# Altium schematic sheet loom-rear-LV-box.SchDoc
size 420 x 297 mm
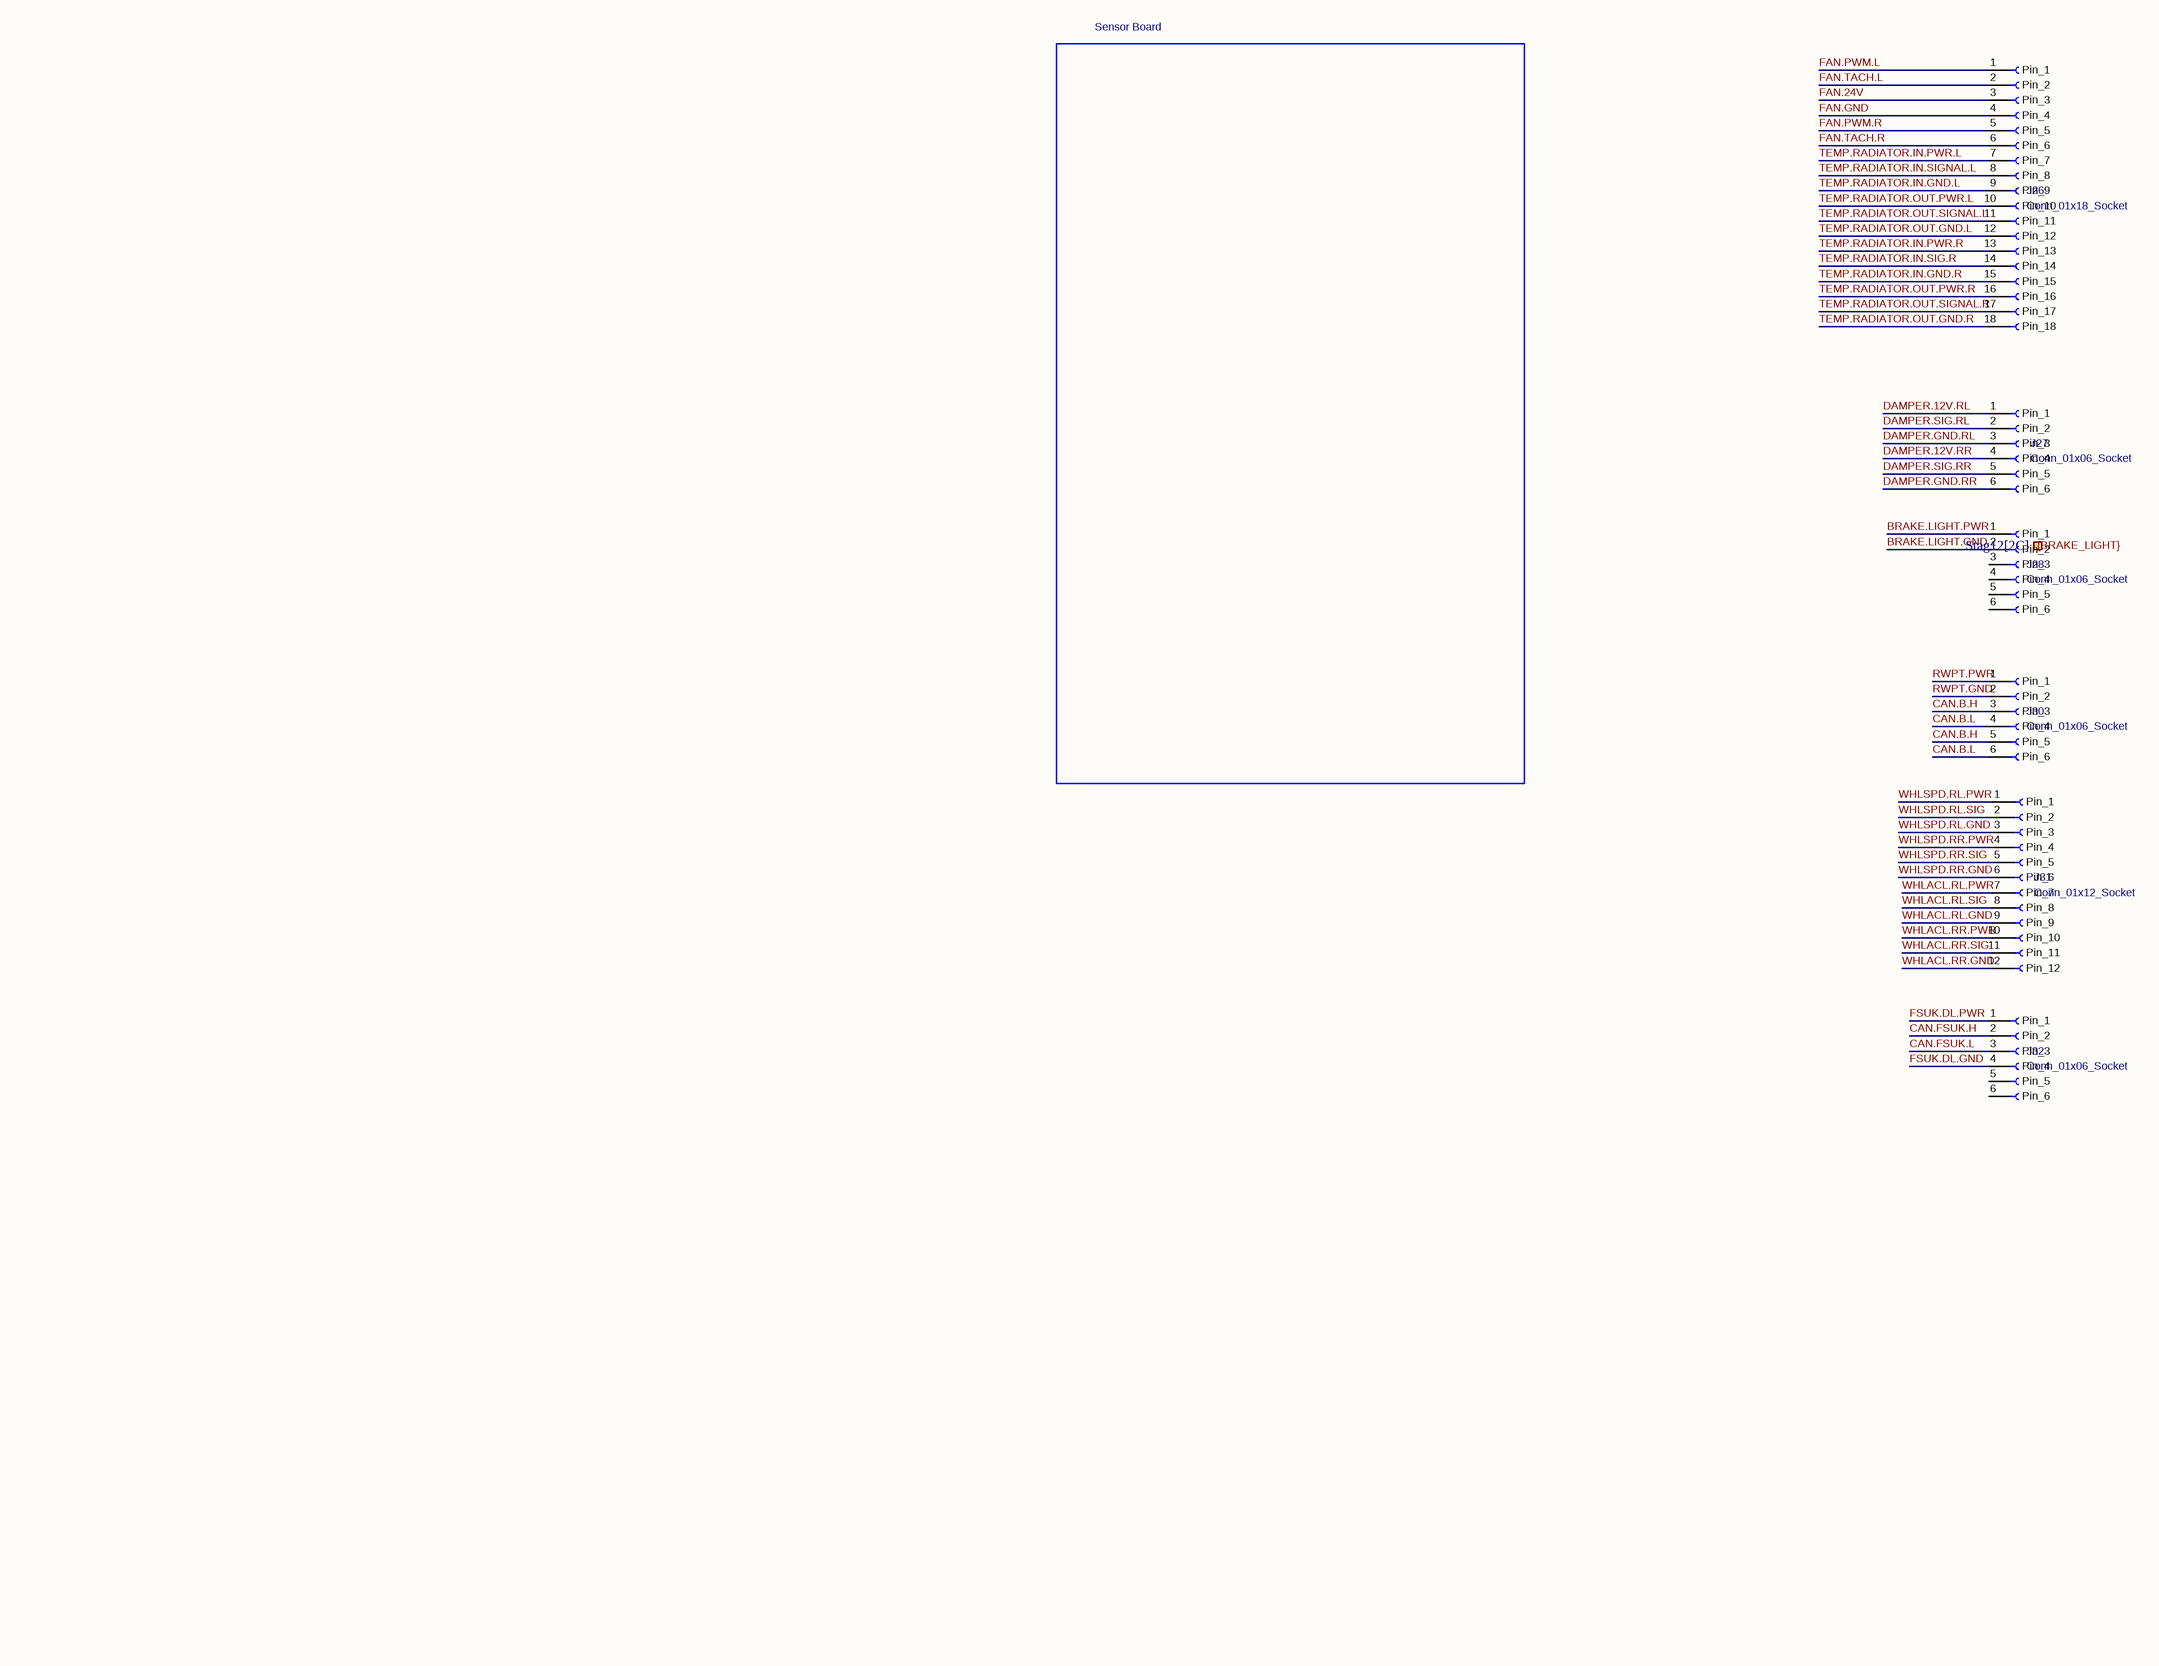
[diagram p0: loom-rear-LV-box.SchDoc]

## Parts
J26  Conn_01x18_Socket
J27  Conn_01x06_Socket
J28  Conn_01x06_Socket
J30  Conn_01x06_Socket
J31  Conn_01x12_Socket
J32  Conn_01x06_Socket

## Ports
{BRAKE_LIGHT} (in, see Stag12[2C])

## Nets
BRAKE.LIGHT.GND: J28.2(Pin_2)
BRAKE.LIGHT.PWR: J28.1(Pin_1)
CAN.B.H: J30.3(Pin_3) J30.5(Pin_5)
CAN.B.L: J30.4(Pin_4) J30.6(Pin_6)
CAN.FSUK.H: J32.2(Pin_2)
CAN.FSUK.L: J32.3(Pin_3)
DAMPER.12V.RL: J27.1(Pin_1)
DAMPER.12V.RR: J27.4(Pin_4)
DAMPER.GND.RL: J27.3(Pin_3)
DAMPER.GND.RR: J27.6(Pin_6)
DAMPER.SIG.RL: J27.2(Pin_2)
DAMPER.SIG.RR: J27.5(Pin_5)
FAN.24V: J26.3(Pin_3)
FAN.GND: J26.4(Pin_4)
FAN.PWM.L: J26.1(Pin_1)
FAN.PWM.R: J26.5(Pin_5)
FAN.TACH.L: J26.2(Pin_2)
FAN.TACH.R: J26.6(Pin_6)
FSUK.DL.GND: J32.4(Pin_4)
FSUK.DL.PWR: J32.1(Pin_1)
RWPT.GND: J30.2(Pin_2)
RWPT.PWR: J30.1(Pin_1)
TEMP.RADIATOR.IN.GND.L: J26.9(Pin_9)
TEMP.RADIATOR.IN.GND.R: J26.15(Pin_15)
TEMP.RADIATOR.IN.PWR.L: J26.7(Pin_7)
TEMP.RADIATOR.IN.PWR.R: J26.13(Pin_13)
TEMP.RADIATOR.IN.SIG.R: J26.14(Pin_14)
TEMP.RADIATOR.IN.SIGNAL.L: J26.8(Pin_8)
TEMP.RADIATOR.OUT.GND.L: J26.12(Pin_12)
TEMP.RADIATOR.OUT.GND.R: J26.18(Pin_18)
TEMP.RADIATOR.OUT.PWR.L: J26.10(Pin_10)
TEMP.RADIATOR.OUT.PWR.R: J26.16(Pin_16)
TEMP.RADIATOR.OUT.SIGNAL.L: J26.11(Pin_11)
TEMP.RADIATOR.OUT.SIGNAL.R: J26.17(Pin_17)
WHLACL.RL.GND: J31.9(Pin_9)
WHLACL.RL.PWR: J31.7(Pin_7)
WHLACL.RL.SIG: J31.8(Pin_8)
WHLACL.RR.GND: J31.12(Pin_12)
WHLACL.RR.PWR: J31.10(Pin_10)
WHLACL.RR.SIG: J31.11(Pin_11)
WHLSPD.RL.GND: J31.3(Pin_3)
WHLSPD.RL.PWR: J31.1(Pin_1)
WHLSPD.RL.SIG: J31.2(Pin_2)
WHLSPD.RR.GND: J31.6(Pin_6)
WHLSPD.RR.PWR: J31.4(Pin_4)
WHLSPD.RR.SIG: J31.5(Pin_5)

Not connected (* = marked no-connect by the designer): J28 3(Pin_3) 4(Pin_4) 5(Pin_5) 6(Pin_6); J32 5(Pin_5) 6(Pin_6)

## Notes on the sheet
- Sensor Board
- 1
- 2
- 3
- 4
- 5
- 6
- 7
- 8
- A
- B
- C
- D
- E
- Title:
- File: loom-rear-LV-box.kicad_sch
- Sheet: /
- F
- KiCad E.D.A.  kicad (5.1.4)-1
- Size: A3
- Date:
- Rev:
- Id: 1/1

## Library data of the parts
J26 = Conn_01x18_Socket: Value: Conn_01x18_Socket
J27 J28 J30 J32 = Conn_01x06_Socket: Value: Conn_01x06_Socket
J31 = Conn_01x12_Socket: Value: Conn_01x12_Socket